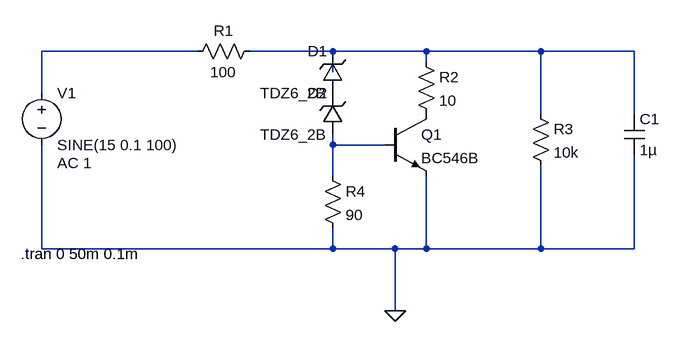
[diagram p0: schematic reg_paralelo_npn.asc]
reg_paralelo_npn.asc, the LTspice schematic file:
Version 4
SHEET 1 2204 680
WIRE 288 80 48 80
WIRE 496 80 368 80
WIRE 640 80 496 80
WIRE 816 80 640 80
WIRE 960 80 816 80
WIRE 640 96 640 80
WIRE 496 112 496 80
WIRE 48 144 48 80
WIRE 816 176 816 80
WIRE 960 176 960 80
WIRE 496 224 496 208
WIRE 576 224 496 224
WIRE 496 272 496 224
WIRE 48 384 48 224
WIRE 496 384 496 352
WIRE 496 384 48 384
WIRE 592 384 496 384
WIRE 640 384 640 272
WIRE 640 384 592 384
WIRE 816 384 816 256
WIRE 816 384 640 384
WIRE 960 384 960 240
WIRE 960 384 816 384
WIRE 592 480 592 384
FLAG 592 480 0
SYMBOL voltage 48 128 R0
WINDOW 123 24 124 Left 2
WINDOW 39 0 0 Left 0
SYMATTR Value2 AC 1
SYMATTR InstName V1
SYMATTR Value SINE(15 0.1 100)
SYMBOL res 384 64 R90
WINDOW 0 0 56 VBottom 2
WINDOW 3 32 56 VTop 2
SYMATTR InstName R1
SYMATTR Value 100
SYMBOL res 800 160 R0
SYMATTR InstName R3
SYMATTR Value 10k
SYMBOL cap 944 176 R0
SYMATTR InstName C1
SYMATTR Value 1µ
SYMBOL res 480 256 R0
SYMATTR InstName R4
SYMATTR Value 90
SYMBOL zener 512 144 R180
WINDOW 0 24 64 Left 2
WINDOW 3 24 0 Left 2
SYMATTR InstName D1
SYMATTR Value TDZ6_2B
SYMBOL npn 576 176 R0
SYMATTR InstName Q1
SYMATTR Value BC546B
SYMBOL res 624 80 R0
SYMATTR InstName R2
SYMATTR Value 10
SYMBOL zener 512 208 R180
WINDOW 0 24 64 Left 2
WINDOW 3 24 0 Left 2
SYMATTR InstName D2
SYMATTR Value TDZ6_2B
TEXT 16 392 Left 2 !.tran 0 50m 0.1m

The netlist it stands for:
* reg_paralelo_npn.asc
V1 N001 0 SINE(15 0.1 100) AC 1
R1 N002 N001 100
R3 N002 0 10k
C1 N002 0 1µ
R4 N003 0 90
D1 P001 N002 TDZ6_2B
Q1 P002 N003 0 0 BC546B
R2 N002 P002 10
D2 N003 P001 TDZ6_2B
.model D D
.lib standard.dio
.model NPN NPN
.model PNP PNP
.lib standard.bjt
.tran 0 50m 0.1m
.backanno
.end